# Altium schematic sheet DriverSPI.SchDoc
size A3
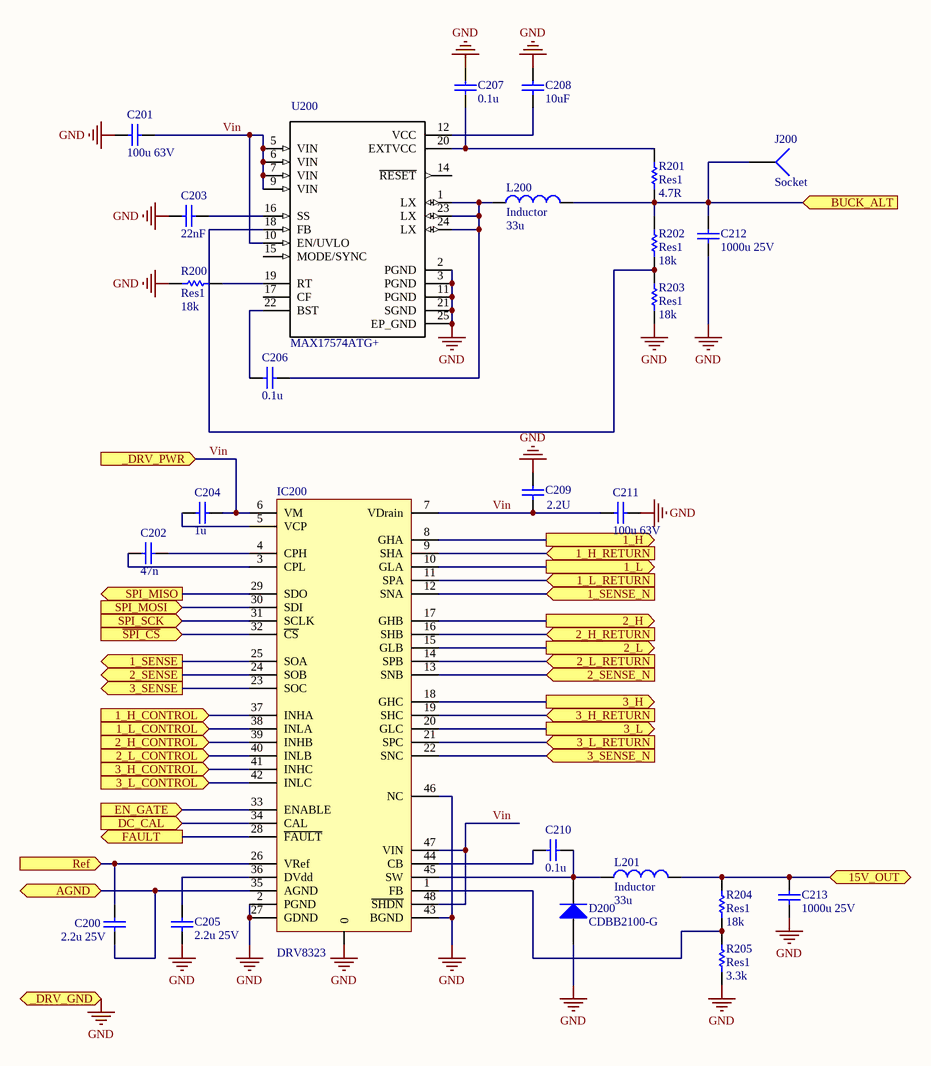
[diagram p0: DriverSPI.SchDoc]

## Parts
C200  2.2u 25V  [1206x]
C201  100u 63V  [CAP_ELEC_10mm]
C202  47n  [0603x]
C203  22nF  [0603x]
C204  1u  [0805x]
C205  2.2u 25V  [1206x]
C206  0.1u  [0603x]
C207  0.1u  [0603x]
C208  10uF  [1206x]
C209  2.2U  [1210]
C210  0.1u  [0603x]
C211  100u 63V  [CAP_ELEC_10mm]
C212  1000u 25V  [CAP_ELEC_10mm]
C213  1000u 25V  [CAP_ELEC_10mm]
D200  CDBB2100-G  [SMB_real]
IC200  DRV8323  [PWQFN-48]
J200  Socket  [PIN1]
L200  Inductor  value 33u  [DR74]
L201  Inductor  value 33u  [DR74]
R200  Res1  value 18k  [0603x]
R201  Res1  value 4.7R  [0603x]
R202  Res1  value 18k  [0603x]
R203  Res1  value 18k  [0603x]
R204  Res1  value 18k  [0603x]
R205  Res1  value 3.3k  [0603x]
U200  MAX17574ATG+  [QFN50P500X400X80-25N]

## Ports
1_H (out), 1_H_CONTROL (in), 1_H_RETURN (in), 1_L (out), 1_L_CONTROL (in), 1_L_RETURN (in), 1_SENSE (out), 1_SENSE_N (in), 2_H (out), 2_H_CONTROL (in), 2_H_RETURN (in), 2_L (out), 2_L_CONTROL (in), 2_L_RETURN (in), 2_SENSE (out), 2_SENSE_N (in), 3_H (out), 3_H_CONTROL (in), 3_H_RETURN (in), 3_L (out), 3_L_CONTROL (in), 3_L_RETURN (in), 3_SENSE (out), 3_SENSE_N (in), 15V_OUT, _DRV_GND (bidir), _DRV_PWR (in), AGND (bidir), BUCK_ALT (in), DC_CAL (in), EN_GATE (in), FAULT (out), Ref (in), SPI_MISO (out), SPI_MOSI (in), SPI_SCK (in), ~{SPI_CS} (in)

## Nets
GND: C201.2 C203.1 C205.1 C207.2 C208.2 C209.2 C211.1 C212.2 C213.2 D200.1(A) IC200.0 IC200.2(PGND) IC200.27(GDND) IC200.43(BGND) IC200.46(NC) R200.2 R203.1 R205.1 U200.2(PGND) U200.3(PGND) U200.11(PGND) U200.21(SGND) U200.25(EP_GND) ; port _DRV_GND
1_H: IC200.8(GHA) ; port 1_H
1_H_CONTROL: IC200.37(INHA) ; port 1_H_CONTROL
1_H_RETURN: IC200.9(SHA) ; port 1_H_RETURN
1_L: IC200.10(GLA) ; port 1_L
1_L_CONTROL: IC200.38(INLA) ; port 1_L_CONTROL
1_L_RETURN: IC200.11(SPA) ; port 1_L_RETURN
1_SENSE: IC200.25(SOA) ; port 1_SENSE
1_SENSE_N: IC200.12(SNA) ; port 1_SENSE_N
2_H: IC200.17(GHB) ; port 2_H
2_H_CONTROL: IC200.39(INHB) ; port 2_H_CONTROL
2_H_RETURN: IC200.16(SHB) ; port 2_H_RETURN
2_L: IC200.15(GLB) ; port 2_L
2_L_CONTROL: IC200.40(INLB) ; port 2_L_CONTROL
2_L_RETURN: IC200.14(SPB) ; port 2_L_RETURN
2_SENSE: IC200.24(SOB) ; port 2_SENSE
2_SENSE_N: IC200.13(SNB) ; port 2_SENSE_N
3_H: IC200.18(GHC) ; port 3_H
3_H_CONTROL: IC200.41(INHC) ; port 3_H_CONTROL
3_H_RETURN: IC200.19(SHC) ; port 3_H_RETURN
3_L: IC200.20(GLC) ; port 3_L
3_L_CONTROL: IC200.42(INLC) ; port 3_L_CONTROL
3_L_RETURN: IC200.21(SPC) ; port 3_L_RETURN
3_SENSE: IC200.23(SOC) ; port 3_SENSE
3_SENSE_N: IC200.22(SNC) ; port 3_SENSE_N
15V_OUT: C213.1 L201.2 R204.2 ; port 15V_OUT
AGND: C200.1 IC200.35(AGND) ; port AGND
BUCK_ALT: C212.1 J200.1 L200.2 R201.2 R202.2 ; port BUCK_ALT
DC_CAL: IC200.34(CAL) ; port DC_CAL
EN_GATE: IC200.33(ENABLE) ; port EN_GATE
FAULT: IC200.28(~{FAULT}) ; port FAULT
Ref: C200.2 IC200.26(VRef) ; port Ref
~{SPI_CS}: IC200.32(~{CS}) ; port ~{SPI_CS}
SPI_MISO: IC200.29(SDO) ; port SPI_MISO
SPI_MOSI: IC200.30(SDI) ; port SPI_MOSI
SPI_SCK: IC200.31(SCLK) ; port SPI_SCK
Vin: C201.1 C204.2 C209.1 C211.2 IC200.6(VM) IC200.7(VDrain) IC200.47(VIN) IC200.48(~{SHDN}) U200.5(VIN) U200.6(VIN) U200.7(VIN) U200.9(VIN) U200.10(EN/UVLO) ; port _DRV_PWR
NetC202_1: C202.1 IC200.3(CPL)
NetC202_2: C202.2 IC200.4(CPH)
NetC203_2: C203.2 U200.16(SS)
NetC204_1: C204.1 IC200.5(VCP)
NetC205_2: C205.2 IC200.36(DVdd)
NetC206_1: C206.1 U200.22(BST)
NetC206_2: C206.2 L200.1 U200.1(LX) U200.23(LX) U200.24(LX)
NetC207_1: C207.1 R201.1 U200.20(EXTVCC)
NetC208_1: C208.1 U200.12(VCC)
NetC210_1: C210.1 IC200.44(CB)
NetC210_2: C210.2 D200.2(K) IC200.45(SW) L201.1
NetIC200_1: IC200.1(FB) R204.1 R205.2
NetR200_1: R200.1 U200.19(RT)
NetR202_1: R202.1 R203.2 U200.18(FB)

Not connected (* = marked no-connect by the designer): U200 14(~{RESET}) 15(MODE/SYNC) 17(CF)

## Notes on the sheet
- Title
- Size:
- Date:
- A3
- Number:
- Time:
- Revision:
- Sheet
- of
- File:

## Library data of the parts
C200-C213 = Cap: Capacitor; Value: 100pF; Published: 8-Jun-2000; LatestRevisionDate: 17-Jul-2002; LatestRevisionNote: Re-released for DXP Platform.; PackageReference: RAD-0.3; Publisher: Altium Limited; PackageDescription: Radial Cap, Thru-Hole; 2 Leads; 0.3 in Pin Spacing
D200 = Diode: Default Diode; Published: 8-Jun-2000; LatestRevisionDate: 17-Jul-2002; LatestRevisionNote: Re-released for DXP Platform.; PackageVersion: Sep-1996; PackageReference: SMC; Publisher: Altium Limited; PackageDescription: DO-214-AB/SMC; 2 C-Bend Leads; Body 7.9 x 5.9 mm, inc. leads (LxW); Code_JEDEC: DO-214-AB
L200 L201 = Inductor: Code_IEC: 1005; Published: 8-Jun-2000; LatestRevisionDate: 29-May-2009; LatestRevisionNote: IPC-7351 Footprint Added.; PackageReference: 0402-A; Publisher: Altium Limited; PackageDescription: Chip Inductor; Code_JEITA: 0402
R200-R205 = Res1: Resistor; Published: 8-Jun-2000; LatestRevisionDate: 17-Jul-2002; LatestRevisionNote: Re-released for DXP Platform.; PackageReference: AXIAL-0.3; Publisher: Altium Limited; PackageDescription: Axial Device, Thru-Hole; 2 Leads; 0.3 in Pin Spacing
U200 = MAX17574ATG+: IC REG BUCK ADJ 3A SYNC 24TQFN; MF: Maxim Integrated; MP: MAX17574ATG+; Package: TQFN-24 Maxim Integrated; Digi-Key_Part_Number: MAX17574ATG+-ND; Digi-Key_Purchase_URL: https://www.digikey.com/product-detail/en/maxim-integrated/MAX17574ATG-/MAX17574ATG--ND/6579157?WT.z_cid=ref_snapeda&utm_source=snapeda&utm_medium=aggregator&utm_campaign=buynow; Value: *
J200 = Socket: LatestRevisionDate: 17-Jul-2002; LatestRevisionNote: Re-released for DXP Platform.; Publisher: Altium Limited